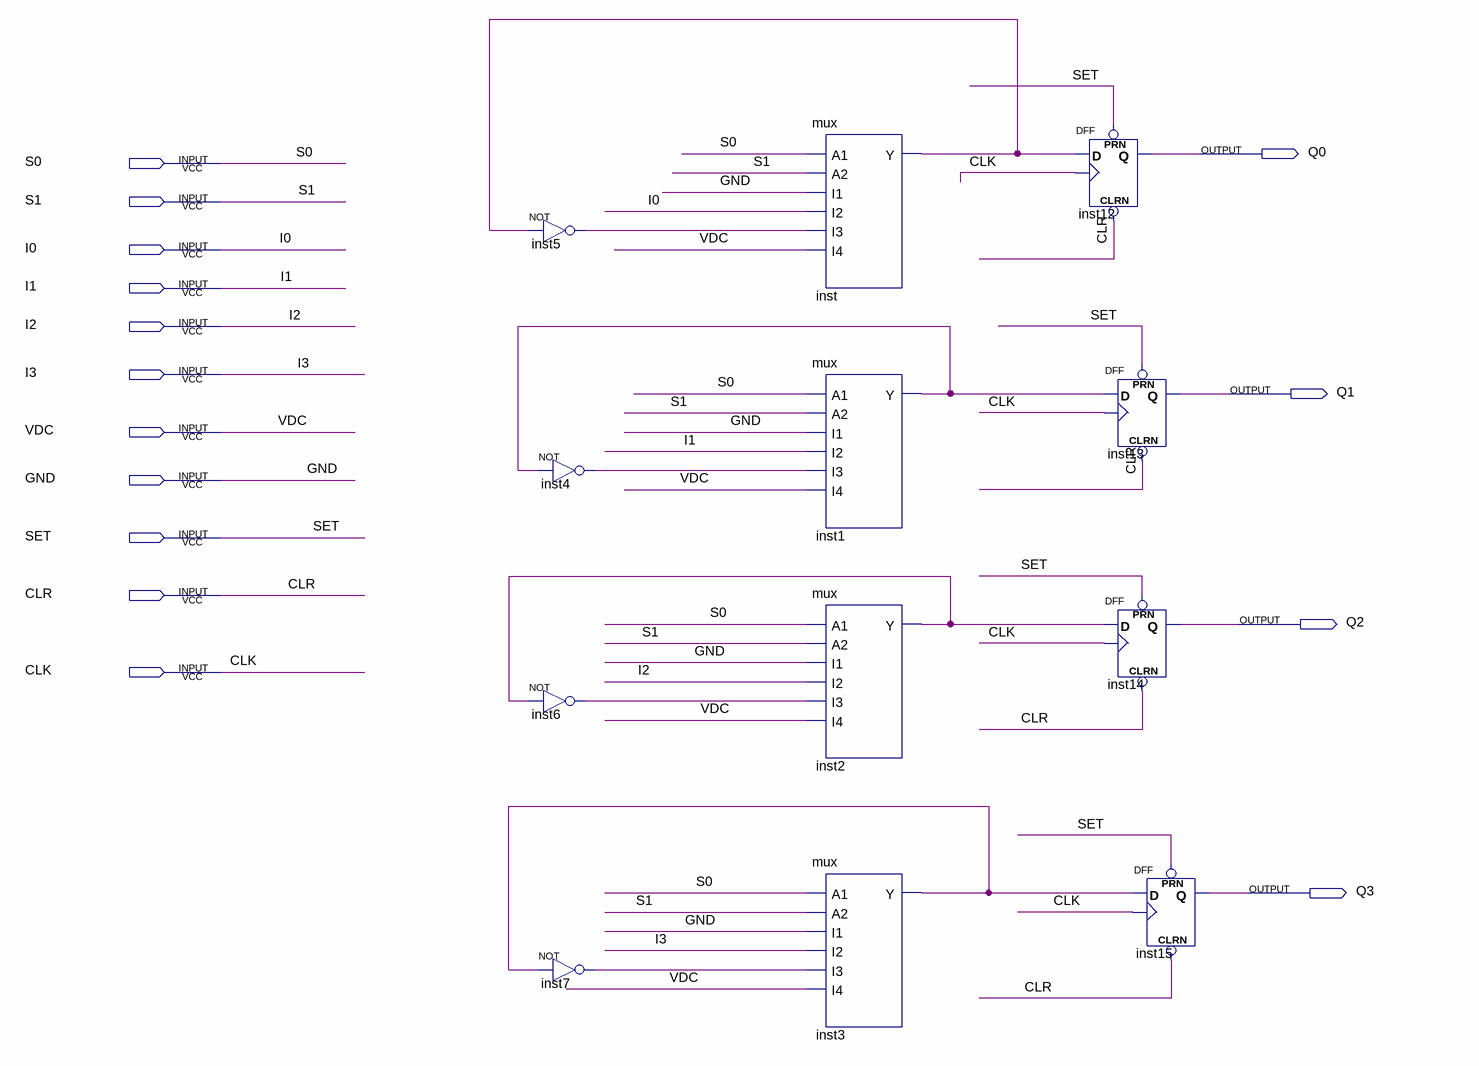
[diagram p0: schematic sheet]
// Quartus schematic ex1p8.bdf as structural Verilog: 12 symbols, 15 pins
module ex1p8 (
  input  S0,
  input  S1,
  input  I0,
  input  I1,
  input  I2,
  input  I3,
  input  VDC,
  input  GND,
  input  SET,
  input  CLR,
  input  CLK,
  output Q0,
  output Q1,
  output Q2,
  output Q3
);

  wire inst2_y, inst4_out, inst5_out, inst6_out, inst7_out;

  not inst5 (inst5_out, inst5_out);
  not inst4 (inst4_out, inst4_out);
  not inst6 (inst6_out, inst2_y);
  not inst7 (inst7_out, inst7_out);
  mux inst (.A1(S0), .A2(S1), .I1(GND), .I2(I0), .I3(inst5_out), .I4(VDC), .Y(inst5_out));
  mux inst1 (.A1(S0), .A2(S1), .I1(GND), .I2(I1), .I3(inst4_out), .I4(VDC), .Y(inst4_out));
  mux inst2 (.A1(S0), .A2(S1), .I1(GND), .I2(I2), .I3(inst6_out), .I4(VDC), .Y(inst2_y));
  mux inst3 (.A1(S0), .A2(S1), .I1(GND), .I2(I3), .I3(inst7_out), .I4(VDC), .Y(inst7_out));
  DFF inst12 (.CLRN(CLR), .CLK(CLK), .D(inst5_out), .PRN(SET), .Q(Q0));
  DFF inst13 (.CLRN(CLR), .CLK(CLK), .D(inst4_out), .PRN(SET), .Q(Q1));
  DFF inst14 (.CLRN(CLR), .CLK(CLK), .D(inst2_y), .PRN(SET), .Q(Q2));
  DFF inst15 (.CLRN(CLR), .CLK(CLK), .D(inst7_out), .PRN(SET), .Q(Q3));
endmodule
